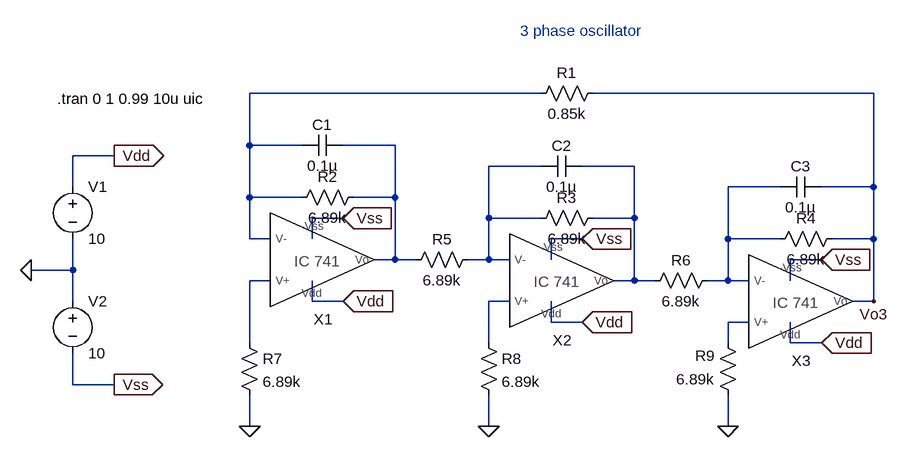
[diagram p0: schematic three phase oscillator.asc]
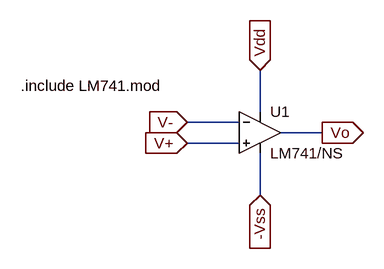
[diagram p1: sub-circuit ic741.asc]
three phase oscillator.asc, the LTspice schematic file:
Version 4
SHEET 1 880 680
WIRE 304 -64 -144 -64
WIRE 816 -64 384 -64
WIRE -144 16 -144 -64
WIRE -64 16 -144 16
WIRE 80 16 0 16
WIRE -352 32 -416 32
WIRE 304 48 224 48
WIRE 448 48 368 48
WIRE -416 80 -416 32
WIRE 672 80 592 80
WIRE 816 80 816 -64
WIRE 816 80 736 80
WIRE -144 96 -144 16
WIRE -64 96 -144 96
WIRE 80 96 80 16
WIRE 80 96 16 96
WIRE 0 128 -48 128
WIRE 224 128 224 48
WIRE 304 128 224 128
WIRE 448 128 448 48
WIRE 448 128 384 128
WIRE -144 160 -144 96
WIRE -112 160 -144 160
WIRE -48 160 -48 128
WIRE 368 160 320 160
WIRE 592 160 592 80
WIRE 672 160 592 160
WIRE 816 160 816 80
WIRE 816 160 752 160
WIRE 80 192 80 96
WIRE 80 192 48 192
WIRE 112 192 80 192
WIRE 224 192 224 128
WIRE 224 192 192 192
WIRE 256 192 224 192
WIRE 320 192 320 160
WIRE 736 192 688 192
WIRE -416 208 -416 160
WIRE -416 208 -480 208
WIRE -112 224 -144 224
WIRE 448 224 448 128
WIRE 448 224 416 224
WIRE 480 224 448 224
WIRE 592 224 592 160
WIRE 592 224 560 224
WIRE 624 224 592 224
WIRE 688 224 688 192
WIRE -416 256 -416 208
WIRE -48 256 -48 224
WIRE 0 256 -48 256
WIRE 256 256 224 256
WIRE 816 256 816 160
WIRE 816 256 784 256
WIRE 320 288 320 256
WIRE 368 288 320 288
WIRE 624 288 592 288
WIRE -144 320 -144 224
WIRE 224 320 224 256
WIRE 592 320 592 288
WIRE 688 320 688 288
WIRE 736 320 688 320
WIRE -416 384 -416 336
WIRE -352 384 -416 384
WIRE -144 448 -144 400
WIRE 224 448 224 400
WIRE 592 448 592 400
FLAG 0 128 Vss
IOPIN 0 128 In
FLAG 0 256 Vdd
IOPIN 0 256 In
FLAG 368 160 Vss
IOPIN 368 160 In
FLAG 368 288 Vdd
IOPIN 368 288 In
FLAG 736 192 Vss
IOPIN 736 192 In
FLAG 736 320 Vdd
IOPIN 736 320 In
FLAG -144 448 0
FLAG 224 448 0
FLAG 592 448 0
FLAG 816 256 Vo3
FLAG -480 208 0
FLAG -352 32 Vdd
IOPIN -352 32 Out
FLAG -352 384 Vss
IOPIN -352 384 Out
SYMBOL IC741 -32 176 M180
SYMATTR InstName X1
SYMBOL cap 0 0 R90
WINDOW 0 0 32 VBottom 2
WINDOW 3 32 32 VTop 2
SYMATTR InstName C1
SYMATTR Value 0.1µ
SYMBOL res 400 -80 R90
WINDOW 0 0 56 VBottom 2
WINDOW 3 32 56 VTop 2
SYMATTR InstName R1
SYMATTR Value 0.85k
SYMBOL IC741 336 208 M180
SYMATTR InstName X2
SYMBOL cap 368 32 R90
WINDOW 0 0 32 VBottom 2
WINDOW 3 32 32 VTop 2
SYMATTR InstName C2
SYMATTR Value 0.1µ
SYMBOL res 32 80 R90
WINDOW 0 0 56 VBottom 2
WINDOW 3 32 56 VTop 2
SYMATTR InstName R2
SYMATTR Value 6.89k
SYMBOL IC741 704 240 M180
SYMATTR InstName X3
SYMBOL cap 736 64 R90
WINDOW 0 0 32 VBottom 2
WINDOW 3 32 32 VTop 2
SYMATTR InstName C3
SYMATTR Value 0.1µ
SYMBOL res 400 112 R90
WINDOW 0 0 56 VBottom 2
WINDOW 3 32 56 VTop 2
SYMATTR InstName R3
SYMATTR Value 6.89k
SYMBOL res 768 144 R90
WINDOW 0 0 56 VBottom 2
WINDOW 3 32 56 VTop 2
SYMATTR InstName R4
SYMATTR Value 6.89k
SYMBOL res 208 176 R90
WINDOW 0 0 56 VBottom 2
WINDOW 3 32 56 VTop 2
SYMATTR InstName R5
SYMATTR Value 6.89k
SYMBOL res 576 208 R90
WINDOW 0 0 56 VBottom 2
WINDOW 3 32 56 VTop 2
SYMATTR InstName R6
SYMATTR Value 6.89k
SYMBOL res -160 304 R0
SYMATTR InstName R7
SYMATTR Value 6.89k
SYMBOL res 208 304 R0
SYMATTR InstName R8
SYMATTR Value 6.89k
SYMBOL res 608 416 R180
WINDOW 0 36 76 Left 2
WINDOW 3 36 40 Left 2
SYMATTR InstName R9
SYMATTR Value 6.89k
SYMBOL voltage -416 64 R0
WINDOW 123 0 0 Left 0
WINDOW 39 0 0 Left 0
SYMATTR InstName V1
SYMATTR Value 10
SYMBOL voltage -416 240 R0
WINDOW 123 0 0 Left 0
WINDOW 39 0 0 Left 0
SYMATTR InstName V2
SYMATTR Value 10
TEXT 272 -160 Left 2 ;3 phase oscillator
TEXT -440 -56 Left 2 !.tran 0 1 0.99 10u uic

ic741.asc, the sub-circuit schematic file:
Version 4
SHEET 1 880 680
WIRE 368 128 368 64
WIRE 336 144 256 144
WIRE 464 160 400 160
WIRE 336 176 256 176
WIRE 368 256 368 192
FLAG 464 160 Vo
IOPIN 464 160 Out
FLAG 368 64 Vdd
IOPIN 368 64 In
FLAG 368 256 -Vss
IOPIN 368 256 In
FLAG 256 176 V+
IOPIN 256 176 In
FLAG 256 144 V-
IOPIN 256 144 In
SYMBOL OpAmps\\opamp2 368 96 R0
SYMATTR InstName U1
SYMATTR Value LM741/NS
TEXT 0 88 Left 2 !.include LM741.mod

The netlist it stands for:
* three phase oscillator.asc
XX1 Vss N006 N001 Vdd N002 ic741
C1 N002 N001 0.1µ
R1 Vo3 N001 0.85k
XX2 Vss N007 N003 Vdd N004 ic741
C2 N004 N003 0.1µ
R2 N002 N001 6.89k
XX3 Vss N008 N005 Vdd Vo3 ic741
C3 Vo3 N005 0.1µ
R3 N004 N003 6.89k
R4 Vo3 N005 6.89k
R5 N003 N002 6.89k
R6 N005 N004 6.89k
R7 N006 0 6.89k
R8 N007 0 6.89k
R9 0 N008 6.89k
V1 Vdd 0 10
V2 0 Vss 10

* block symbol definitions
.subckt ic741 -Vss V+ V- Vdd Vo
XU1 V+ V- Vdd -Vss Vo LM741/NS  ; pins In+ In- V+ V- OUT
.include LM741.mod
.ends ic741

* 3 phase oscillator
.tran 0 1 0.99 10u uic
.backanno
.end